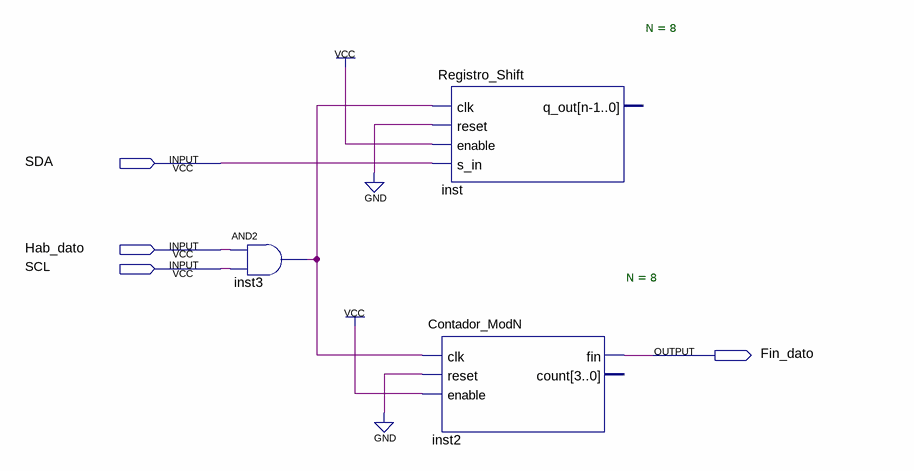
[diagram p0: schematic sheet]
// Quartus schematic GuardaDato.bdf as structural Verilog: 3 symbols, 4 pins
module GuardaDato (
  input  SDA,
  input  Hab_dato,
  input  SCL,
  output Fin_dato
);

  wire inst3_out;

  and inst3 (inst3_out, Hab_dato, SCL);
  Registro_Shift #(.N(8)) inst (.clk(inst3_out), .reset(1'b0), .enable(1'b1), .s_in(SDA));  // open: q_out
  Contador_ModN #(.N(8)) inst2 (.clk(inst3_out), .reset(1'b0), .enable(1'b1), .fin(Fin_dato));  // open: count
endmodule
